# Altium schematic sheet Bluetooth_Sentinel.SchDoc: Bluetooth Sentinel
size A4
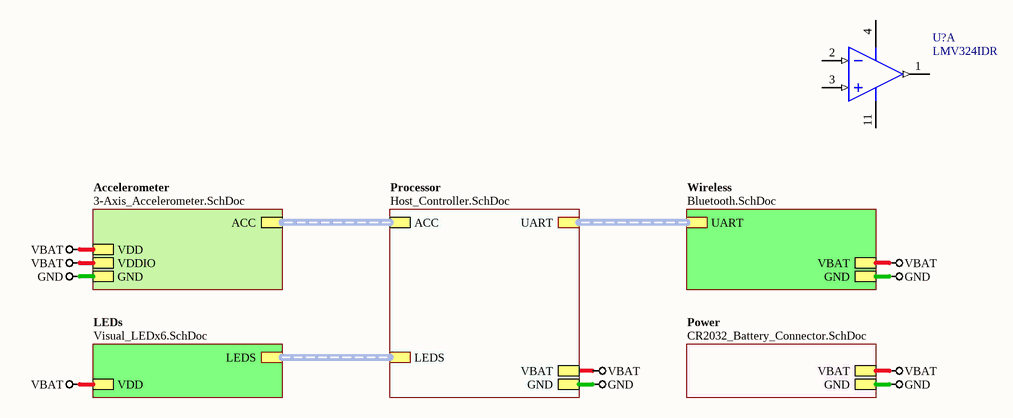
[diagram p0: Bluetooth_Sentinel.SchDoc]

## Parts
U?  LMV324IDR  [D0014A_V]  (part A of 4)

## Sub-sheets
Accelerometer = 3-Axis_Accelerometer.SchDoc: VDD, VDDIO, GND, ACC (harness SPI_LIS331)
LEDs = Visual_LEDx6.SchDoc: VDD, LEDS (harness LEDx6)
Power = CR2032_Battery_Connector.SchDoc: VBAT, GND
Processor = Host_Controller.SchDoc: UART (harness UART_HS), LEDS (harness LEDx6), VBAT, GND, ACC (harness SPI_LIS331)
Wireless = Bluetooth.SchDoc: UART (harness UART_HS), VBAT, GND

## Nets
GND: sheet Power/GND, sheet Wireless/GND, sheet Processor/GND, sheet Accelerometer/GND
VBAT: sheet Power/VBAT, sheet LEDs/VDD, sheet Wireless/VBAT, sheet Processor/VBAT, sheet Accelerometer/VDD, sheet Accelerometer/VDDIO

Not connected (* = marked no-connect by the designer): U? 1(1OUT) 2(1IN-) 3(1IN+) 4(VCC+) 11(GND)

## Buses and harness runs
harness sheet Accelerometer/ACC = sheet Processor/ACC
harness sheet LEDs/LEDS = sheet Processor/LEDS
harness sheet Processor/UART = sheet Wireless/UART

## Notes on the sheet
- Sheet Title
- Project Title
- Size:
- Date:
- A4
- Item:
- Time:
- Revision:
- Sheet
- of
- File:

## Library data of the parts
U? = CMP-014-00025-1: Quad Low-Voltage Rail-to-Rail Output Operational Amplifier, 2.7 to 5.5 V, -40 to 125 degC, 14-Pin SOIC (D), Green (RoHS & no Sb/Br), Tape and Reel; Manufacturer: Texas Instruments (TI); Slew Rate: 1V/us; Nominal Gain Bandwith Product: 1MHz; Nominal Supply Current: 170uA; Min Supply Voltage: 3V; Nominal Voltage Gain: 100dB; Common Mode Rejection Ratio: 50dB; Channels: 4; Output Current: 160mA; Max Supply Voltage: 5V; Package Quantity: 2500; Min Operating Temperature: -40°C; RoHS Compliant: True; Manufacturer URL: http://www.ti.com/; Pins: 14; Unity Gain Bandwidth Product: 1MHz; Package URL: http://www.ti.com/lit/ml/mpds177g/mpds177g.pdf; Datasheet Version: SLOS263W, 10/2014; Mounting Technology: SM; Package Reference: D0014A; Max Operating Temperature: 85°C; Package Description: 14-Pin Small Outline Integrated Circuit, Body 8.65 x 3.9 mm, Pitch 1.27 mm; Case/Package: SOIC; Datasheet URL: http://www.ti.com/lit/ds/symlink/lmv324.pdf; Packaging: TapeandReel